# Altium schematic sheet sensor_input.SchDoc
size 297 x 209 mm
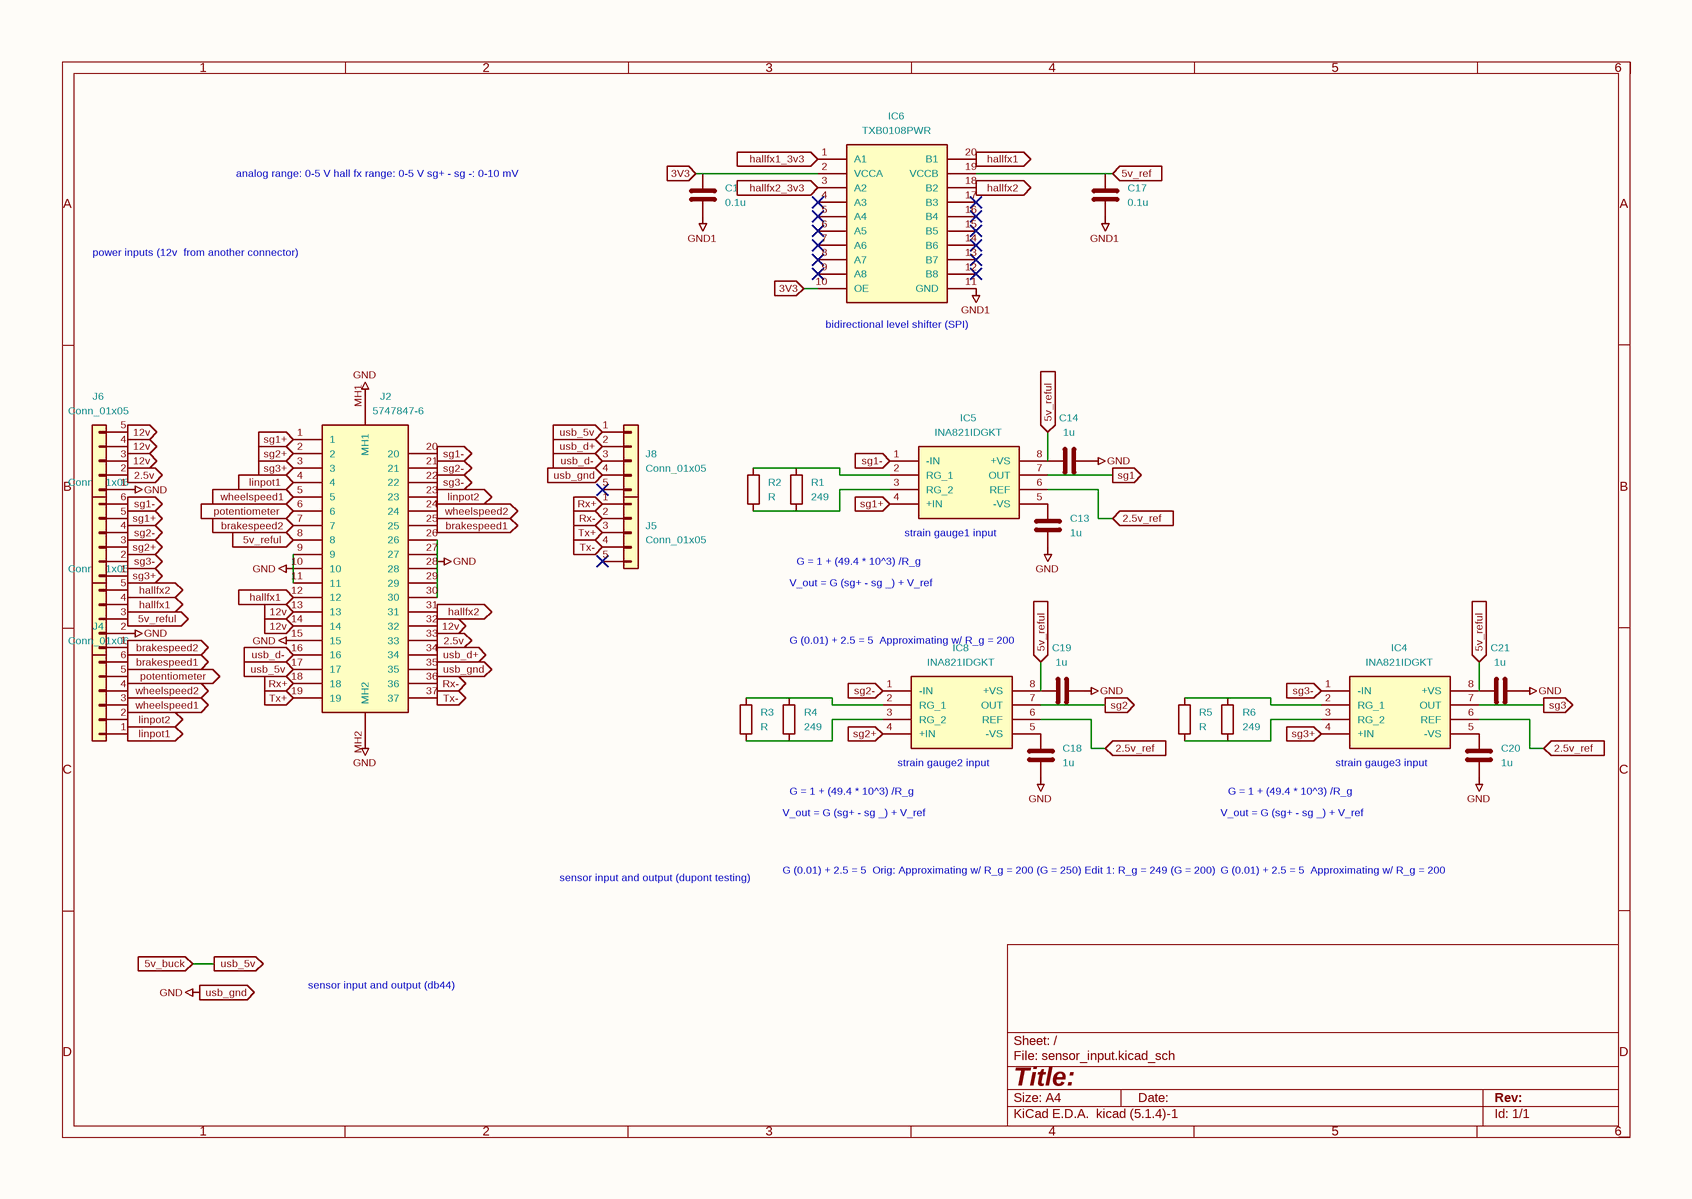
[diagram p0: sensor_input.SchDoc]

## Parts
C12  0.1u  [C_0603_1608Metric]
C13  1u  [C_0603_1608Metric]
C14  1u  [C_0603_1608Metric]
C17  0.1u  [C_0603_1608Metric]
C18  1u  [C_0603_1608Metric]
C19  1u  [C_0603_1608Metric]
C20  1u  [C_0603_1608Metric]
C21  1u  [C_0603_1608Metric]
IC4  INA821IDGKT  [SOP65P490X110-8N]
IC5  INA821IDGKT  [SOP65P490X110-8N]
IC6  TXB0108PWR  [SOP65P640X120-20N]
IC8  INA821IDGKT  [SOP65P490X110-8N]
J2  5747847-6  [57478476]
J3  Conn_01x05  [JST_EH_B5B-EH-A_1x05_P2.50mm_Vertical]
J4  Conn_01x06  [JST_EH_B6B-EH-A_1x06_P2.50mm_Vertical]
J5  Conn_01x05  [JST_EH_B5B-EH-A_1x05_P2.50mm_Vertical]
J6  Conn_01x05  [JST_EH_B5B-EH-A_1x05_P2.50mm_Vertical]
J7  Conn_01x06  [JST_EH_B6B-EH-A_1x06_P2.50mm_Vertical]
J8  Conn_01x05  [JST_EH_B5B-EH-A_1x05_P2.50mm_Vertical]
R1  249  [R_0603_1608Metric]
R2  R  [R_0603_1608Metric]
R3  R  [R_0603_1608Metric]
R4  249  [R_0603_1608Metric]
R5  R  [R_0603_1608Metric]
R6  249  [R_0603_1608Metric]

## Ports
2.5v (in), 2.5v_ref (in), 3V3 (in), 5v_buck (in), 5v_ref (in), 5v_reful (in), 12v (in), brakespeed1 (in), brakespeed1 (out), brakespeed2 (in), brakespeed2 (out), hallfx1 (in), hallfx1 (out), hallfx1_3v3 (out), hallfx2 (in), hallfx2 (out), hallfx2_3v3 (out), linpot1 (in), linpot1 (out), linpot2 (in), linpot2 (out), potentiometer (in), potentiometer (out), Rx+ (in), Rx+ (out), Rx- (in), Rx- (out), sg1 (out), sg1+ (in), sg1+ (out), sg1- (in), sg1- (out), sg2 (out), sg2+ (in), sg2+ (out), sg2- (in), sg2- (out), sg3 (out), sg3+ (in), sg3+ (out), sg3- (in), sg3- (out), Tx+ (in), Tx+ (out), Tx- (in), Tx- (out), usb_5v (in), usb_5v (out), usb_d+ (in), usb_d+ (out), usb_d- (in), usb_d- (out), usb_gnd (in), usb_gnd (out), wheelspeed1 (in), wheelspeed1 (out), wheelspeed2 (in), wheelspeed2 (out)

## Nets
GND: C13.2 C14.2 C18.2 C19.2 C20.2 C21.2 J2.9 J2.10 J2.11 J2.15 J2.26 J2.27 J2.28 J2.29 J2.30 J2.35 J2.MH1 J2.MH2 J3.2(Pin_2) J6.1(Pin_1) J8.4(Pin_4) ; port usb_gnd
GND1: C12.2 C17.2 IC6.11(GND)
2.5v: J2.33 J6.2(Pin_2) ; port 2.5v
2.5v_ref: IC4.6(REF) IC5.6(REF) IC8.6(REF) ; port 2.5v_ref
3V3: C12.1 IC6.2(VCCA) IC6.10(OE) ; port 3V3
5v_buck: J2.17 J8.1(Pin_1) ; port usb_5v, port 5v_buck
5v_ref: C17.1 IC6.19(VCCB) ; port 5v_ref
5v_reful: C14.1 C19.1 C21.1 IC4.8(+VS) IC5.8(+VS) IC8.8(+VS) J2.8 J3.3(Pin_3) ; port 5v_reful
12v: J2.13 J2.14 J2.32 J6.3(Pin_3) J6.4(Pin_4) J6.5(Pin_5) ; port 12v
brakespeed1: J2.25 J4.6(Pin_6) ; port brakespeed1
brakespeed2: J2.7 J3.1(Pin_1) ; port brakespeed2
hallfx1: IC6.20(B1) J2.12 J3.4(Pin_4) ; port hallfx1
hallfx1_3v3: IC6.1(A1) ; port hallfx1_3v3
hallfx2: IC6.18(B2) J2.31 J3.5(Pin_5) ; port hallfx2
hallfx2_3v3: IC6.3(A2) ; port hallfx2_3v3
linpot1: J2.4 J4.1(Pin_1) ; port linpot1
linpot2: J2.23 J4.2(Pin_2) ; port linpot2
potentiometer: J2.6 J4.5(Pin_5) ; port potentiometer
Rx+: J2.18 J5.1(Pin_1) ; port Rx+
Rx-: J2.36 J5.2(Pin_2) ; port Rx-
sg1: IC5.7(OUT) ; port sg1
sg1+: IC5.4(+IN) J2.1 J7.5(Pin_5) ; port sg1+
sg1-: IC5.1(-IN) J2.20 J7.6(Pin_6) ; port sg1-
sg2: IC8.7(OUT) ; port sg2
sg2+: IC8.4(+IN) J2.2 J7.3(Pin_3) ; port sg2+
sg2-: IC8.1(-IN) J2.21 J7.4(Pin_4) ; port sg2-
sg3: IC4.7(OUT) ; port sg3
sg3+: IC4.4(+IN) J2.3 J7.1(Pin_1) ; port sg3+
sg3-: IC4.1(-IN) J2.22 J7.2(Pin_2) ; port sg3-
Tx+: J2.19 J5.3(Pin_3) ; port Tx+
Tx-: J2.37 J5.4(Pin_4) ; port Tx-
usb_d+: J2.34 J8.2(Pin_2) ; port usb_d+
usb_d-: J2.16 J8.3(Pin_3) ; port usb_d-
wheelspeed1: J2.5 J4.3(Pin_3) ; port wheelspeed1
wheelspeed2: J2.24 J4.4(Pin_4) ; port wheelspeed2
NetC13_1: C13.1 IC5.5(-VS)
NetC18_1: C18.1 IC8.5(-VS)
NetC20_1: C20.1 IC4.5(-VS)
NetIC4_2: IC4.2(RG_1) R5.1 R6.1
NetIC4_3: IC4.3(RG_2) R5.2 R6.2
NetIC5_2: IC5.2(RG_1) R1.1 R2.1
NetIC5_3: IC5.3(RG_2) R1.2 R2.2
NetIC8_2: IC8.2(RG_1) R3.1 R4.1
NetIC8_3: IC8.3(RG_2) R3.2 R4.2

Not connected (* = marked no-connect by the designer): IC6 4(A3)* 5(A4)* 6(A5)* 7(A6)* 8(A7)* 9(A8)* 12(B8)* 13(B7)* 14(B6)* 15(B5)* 16(B4)* 17(B3)*; J5 5(Pin_5)*; J8 5(Pin_5)*

## Notes on the sheet
- analog range: 0-5 V
  hall fx range: 0-5 V
  sg+ - sg -: 0-10 mV
- power inputs (12v
  from another connector)
- (near IC6) bidirectional level shifter (SPI)
- G = 1 + (49.4 * 10^3) /R_g
- (near IC5) strain gauge1 input
- V_out = G (sg+ - sg _) + V_ref
- G (0.01) + 2.5 = 5
  Approximating w/ R_g = 200
- (near IC8) strain gauge2 input
- (near IC4) strain gauge3 input
- sensor input and output
  (dupont testing)
- G (0.01) + 2.5 = 5
  Orig: Approximating w/ R_g = 200 (G = 250)
  Edit 1: R_g = 249 (G = 200)
- sensor input and output
  (db44)
- 1
- 2
- 3
- 4
- 5
- 6
- A
- B
- C
- D
- Title:
- File: sensor_input.kicad_sch
- Sheet: /
- KiCad E.D.A.  kicad (5.1.4)-1
- Size: A4
- Date:
- Rev:
- Id: 1/1

## Library data of the parts
C12-C14 C17-C21 = C: Footprint: Capacitor_SMD:C_0603_1608Metric
  C12 C17: Value: 0.1u
  C13 C14 C18-C21: Value: 1u
IC4 IC5 IC8 = INA821IDGKT: Manufacturer_Name: Texas Instruments; Height: 1.1; Mouser Part Number: 595-INA821IDGKT; Mouser Price/Stock: https://www.mouser.co.uk/ProductDetail/Texas-Instruments/INA821IDGKT?qs=LDGDZb5k%2F%252B8diOW5CeiHfQ%3D%3D; Manufacturer_Part_Number: INA821IDGKT; Value: INA821IDGKT; Footprint: 21xt_footprints:SOP65P490X110-8N
IC6 = TXB0108PWR: Manufacturer_Name: Texas Instruments; Height: 1.2; Mouser Part Number: 595-TXB0108PWR; Mouser Price/Stock: https://www.mouser.co.uk/ProductDetail/Texas-Instruments/TXB0108PWR?qs=oFXvjAmG9EgEUWGWzOVFCA%3D%3D; Manufacturer_Part_Number: TXB0108PWR; Value: TXB0108PWR; Footprint: 21xt_footprints:SOP65P640X120-20N
J2 = 5747847-6: Manufacturer_Name: TE Connectivity; Height: 12.9286; Manufacturer_Part_Number: 5747847-6; Mouser Part Number: 571-5747847-6; Mouser Price/Stock: https://www.mouser.co.uk/ProductDetail/TE-Connectivity/5747847-6?qs=DUjmvCJSYRDRvMVFkAFvlQ%3D%3D; Arrow Part Number: 5747847-6; Arrow Price/Stock: https://www.arrow.com/en/products/5747847-6/te-connectivity?region=nac; Value: 5747847-6; Footprint: 21xt_footprints:57478476
R1 R4 R6 = R: Value: 249; Footprint: Resistor_SMD:R_0603_1608Metric
J3 J5 J6 J8 = Conn_01x05: Value: Conn_01x05; Footprint: Connector_JST:JST_EH_B5B-EH-A_1x05_P2.50mm_Vertical
J4 J7 = Conn_01x06: Value: Conn_01x06; Footprint: Connector_JST:JST_EH_B6B-EH-A_1x06_P2.50mm_Vertical
R2 R3 R5 = R: Value: R; Footprint: Resistor_SMD:R_0603_1608Metric